# EAGLE schematic Rotating Section (EAGLE 9.4.2)
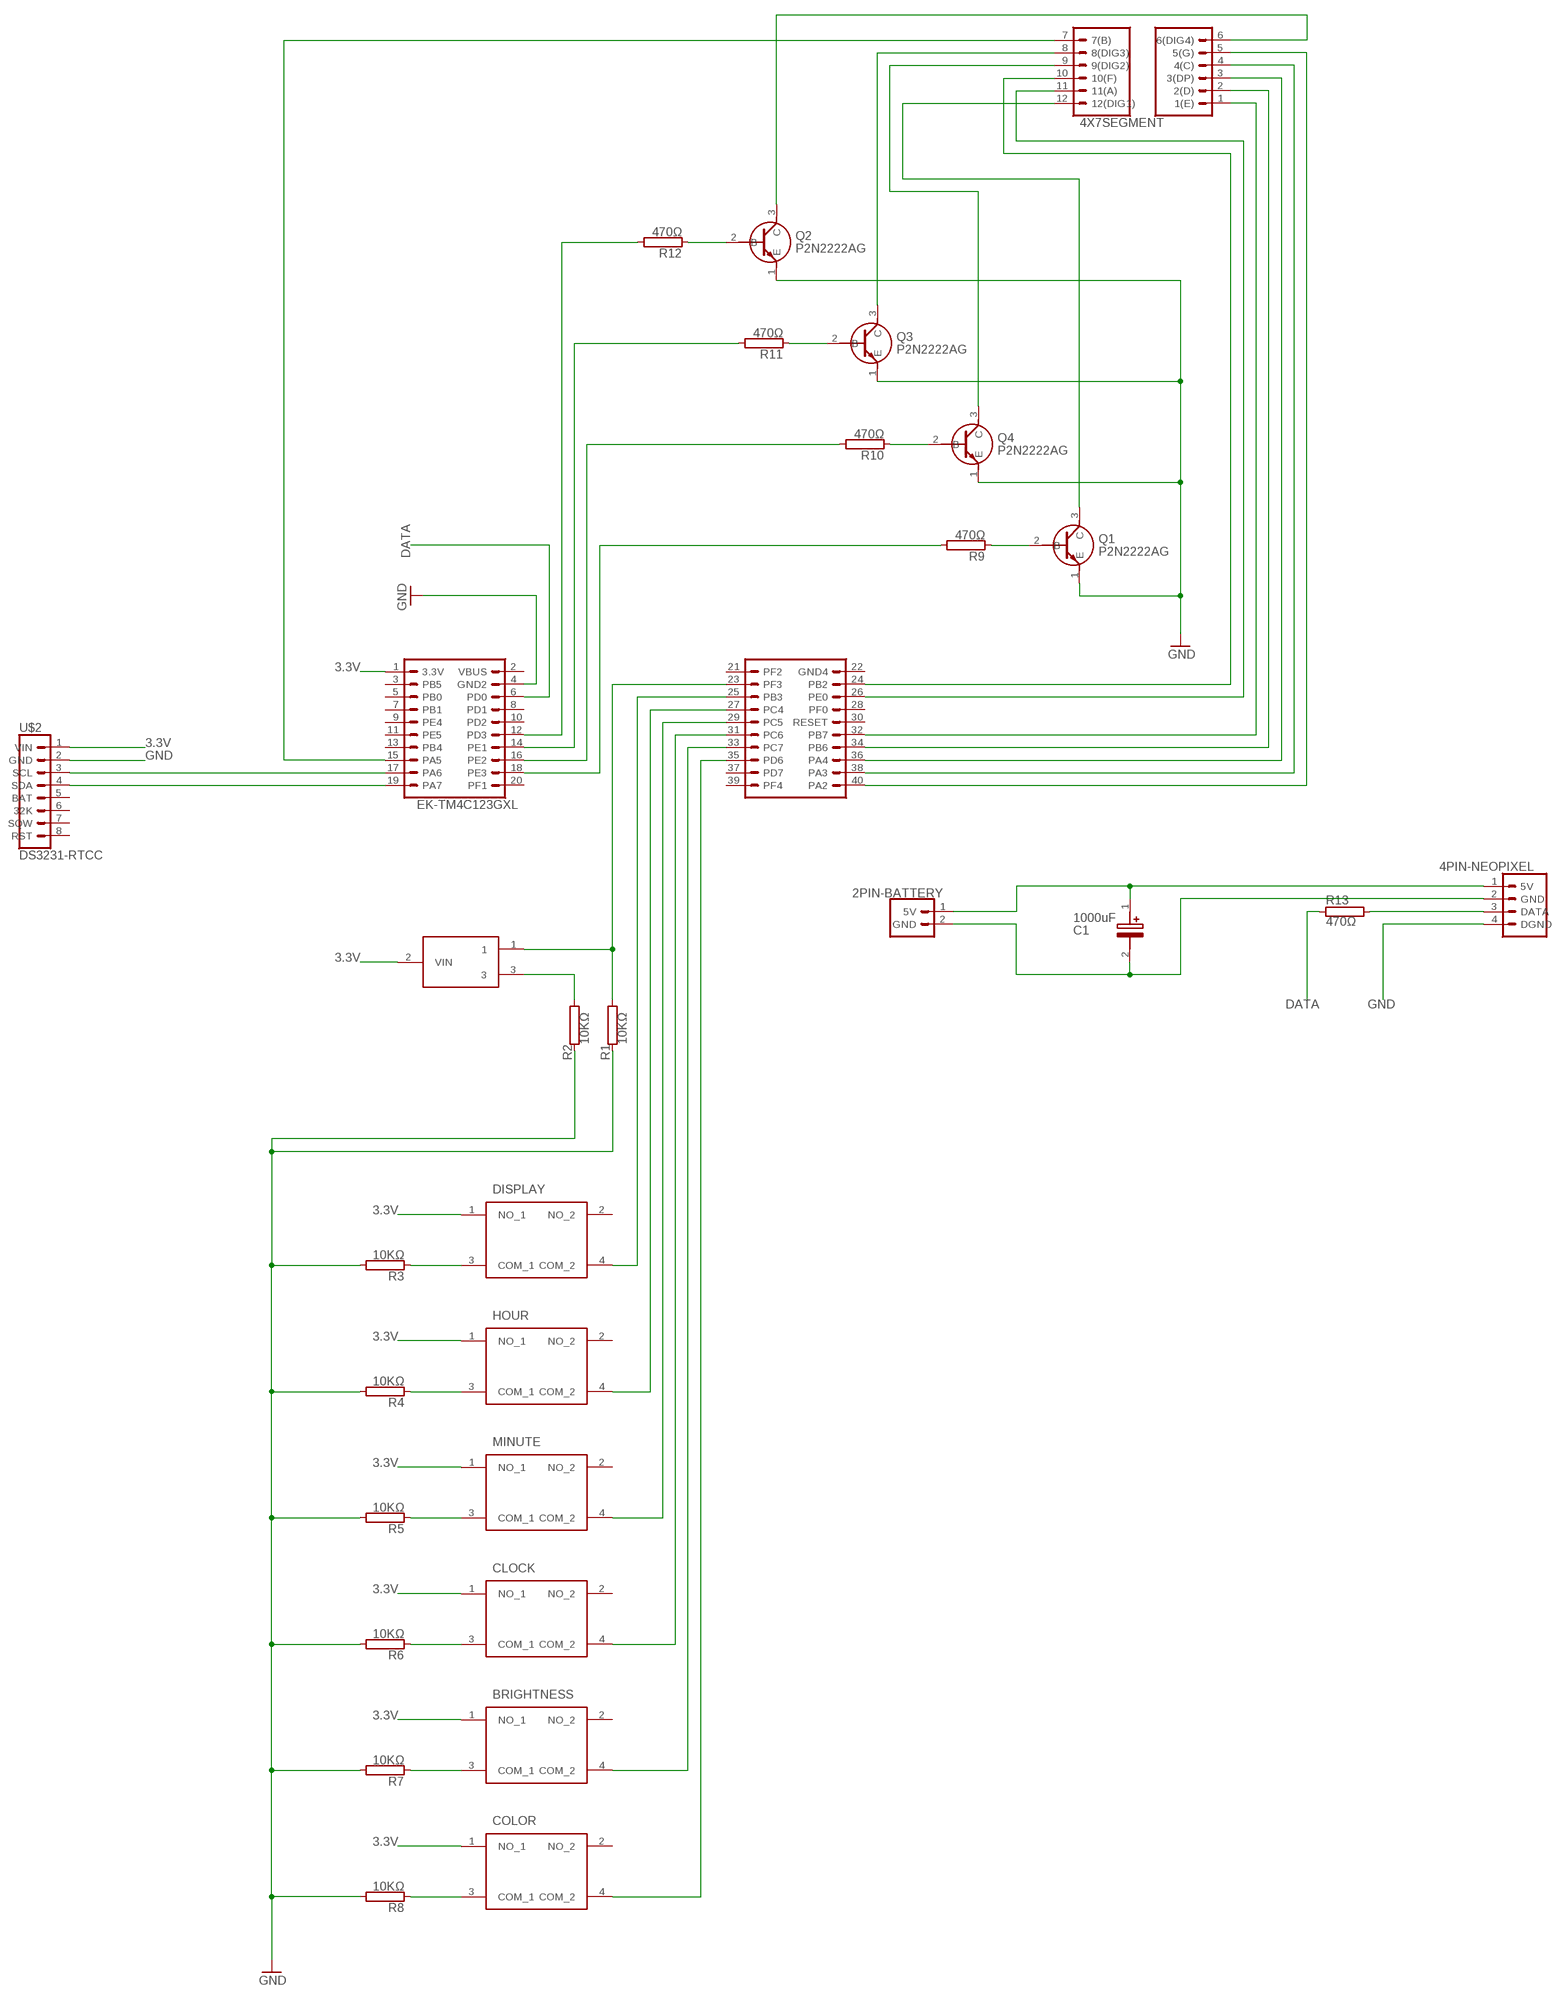
[diagram p0: schematic, sheet 1]

## Parts
BRIGHTNESS  PTS645SL432LFS  [PTS645SL432LFS]
C1  1000uF  EEU-FP1V102  [CAPPRD500W65D1250H2200]
CLOCK  PTS645SL432LFS  [PTS645SL432LFS]
COLOR  PTS645SL432LFS  [PTS645SL432LFS]
DISPLAY  PTS645SL432LFS  [PTS645SL432LFS]
HOUR  PTS645SL432LFS  [PTS645SL432LFS]
MINUTE  PTS645SL432LFS  [PTS645SL432LFS]
Q1  P2N2222AG  [TO-92]
Q2  P2N2222AG  [TO-92]
Q3  P2N2222AG  [TO-92]
Q4  P2N2222AG  [TO-92]
R1  10KΩ  RMG100-V  [TO-247-2V]
R2  10KΩ  RMG100-V  [TO-247-2V]
R3  10KΩ  RMG100-V  [TO-247-2V]
R4  10KΩ  RMG100-V  [TO-247-2V]
R5  10KΩ  RMG100-V  [TO-247-2V]
R6  10KΩ  RMG100-V  [TO-247-2V]
R7  10KΩ  RMG100-V  [TO-247-2V]
R8  10KΩ  RMG100-V  [TO-247-2V]
R9  470Ω  RMG100-V  [TO-247-2V]
R10  470Ω  RMG100-V  [TO-247-2V]
R11  470Ω  RMG100-V  [TO-247-2V]
R12  470Ω  RMG100-V  [TO-247-2V]
R13  470Ω  RMG100-V  [TO-247-2V]
S1  1101M2S3CQE2  [1000-SERIES(SPDT)]
U$1  4X7SEGMENT  [4X7SEGMENT]
U$2  DS3231-RTCC  [1X08]
U$3  EK-TM4C123GXL  [EK-TM4C123GXL]
U$4  4PIN-NEOPIXEL  [4PIN-NEOPIXEL]
U$5  2PIN-BATTERY  [2PIN-BATTERY]

## Nets
3.3V: BRIGHTNESS.1(NO_1) CLOCK.1(NO_1) COLOR.1(NO_1) DISPLAY.1(NO_1) HOUR.1(NO_1) MINUTE.1(NO_1) S1.2(VIN) U$2.1(VIN) U$3.1(3.3V)
DATA: R13.1 U$3.6(PD0)
GND: Q1.1(E) Q2.1(E) Q3.1(E) Q4.1(E) R1.1 R2.1 R3.2 R4.2 R5.2 R6.2 R7.2 R8.2 U$2.2(GND) U$3.4(GND2) U$4.4(DGND)
N$1: U$2.3(SCL) U$3.17(PA6)
N$2: U$2.4(SDA) U$3.19(PA7)
N$3: R2.2 S1.3
N$4: DISPLAY.4(COM_2) U$3.25(PB3)
N$5: R1.2 S1.1 U$3.23(PF3)
N$6: HOUR.4(COM_2) U$3.27(PC4)
N$7: MINUTE.4(COM_2) U$3.29(PC5)
N$8: CLOCK.4(COM_2) U$3.31(PC6)
N$9: BRIGHTNESS.4(COM_2) U$3.33(PC7)
N$10: COLOR.4(COM_2) U$3.35(PD6)
N$11: DISPLAY.3(COM_1) R3.1
N$12: HOUR.3(COM_1) R4.1
N$13: MINUTE.3(COM_1) R5.1
N$14: CLOCK.3(COM_1) R6.1
N$15: BRIGHTNESS.3(COM_1) R7.1
N$16: COLOR.3(COM_1) R8.1
N$17: R9.2 U$3.18(PE3)
N$18: Q1.2(B) R9.1
N$19: R11.2 U$3.14(PE1)
N$20: Q1.3(C) U$1.12(12(DIG1))
N$21: U$1.10(10(F)) U$3.24(PB2)
N$22: U$1.11(11(A)) U$3.26(PE0)
N$23: R10.2 U$3.16(PE2)
N$24: U$1.1(1(E)) U$3.32(PB7)
N$25: U$1.2(2(D)) U$3.34(PB6)
N$26: U$1.3(3(DP)) U$3.36(PA4)
N$27: U$1.4(4(C)) U$3.38(PA3)
N$28: U$1.5(5(G)) U$3.40(PA2)
N$29: U$1.7(7(B)) U$3.15(PA5)
N$30: Q4.2(B) R10.1
N$31: Q3.2(B) R11.1
N$32: R12.2 U$3.12(PD3)
N$33: Q4.3(C) U$1.9(9(DIG2))
N$34: Q3.3(C) U$1.8(8(DIG3))
N$35: Q2.2(B) R12.1
N$36: Q2.3(C) U$1.6(6(DIG4))
N$37: R13.2 U$4.3(DATA)
N$38: C1.1(+) U$4.1(5V) U$5.1(5V)
N$39: C1.2(-) U$4.2(GND) U$5.2(GND)
Unconnected: BRIGHTNESS.2(NO_2) CLOCK.2(NO_2) COLOR.2(NO_2) DISPLAY.2(NO_2) HOUR.2(NO_2) MINUTE.2(NO_2) U$2.6(32K) U$2.7(SQW) U$2.8(RST) U$3.3(PB5) U$3.5(PB0) U$3.7(PB1) U$3.8(PD1) U$3.9(PE4) U$3.10(PD2) U$3.11(PE5) U$3.13(PB4) U$3.20(PF1) U$3.21(PF2) U$3.28(PF0) U$3.30(RESET) U$3.37(PD7) U$3.39(PF4)

## Power pins joined to a net without a drawn wire
BAT: U$2.5(BAT)
GND4: U$3.22(GND4)
VBUS: U$3.2(VBUS)

## Library data of the parts
BRIGHTNESS CLOCK COLOR DISPLAY HOUR MINUTE = PTS645SL432LFS:PTS645SL432LFS: Tactile Switches SWITCH TACTILE Source: Datasheet <https://www.mouser.com/datasheet/2/60/pts645-965362.pdf>; DESCRIPTION: Tactile Switches SWITCH TACTILE; HEIGHT: 4.4mm; MANUFACTURER_NAME: C&K Switches; MANUFACTURER_PART_NUMBER: PTS645SL432LFS; MOUSER_PART_NUMBER: 611-PTS645SL432
C1 = EEU-FP1V102:EEU-FP1V102: Aluminum Electrolytic Capacitors - Radial Leaded 35VDC 1000uF 20% ESR 0.038ohm AECQ200 Source: Datasheet <https://componentsearchengine.com/Datasheets/1/EEU-FP1V102.pdf>; DESCRIPTION: Aluminum Electrolytic Capacitors - Radial Leaded 35VDC 1000uF 20% ESR 0.038ohm AECQ200; HEIGHT: 22mm; MANUFACTURER_NAME: Panasonic; MANUFACTURER_PART_NUMBER: EEU-FP1V102; MOUSER_PART_NUMBER: 667-EEU-FP1V102; MOUSER_PRICE-STOCK: https://www.mouser.com/Search/Refine.aspx?Keyword=667-EEU-FP1V102
Q1-Q4 = 2N2222A:P2N2222AG: NPN transistor,P2N2222A 0.6A Ic 10Vce ON Semi P2N2222AG NPN Bipolar Transistor, 0.6 A 40 V, 3-Pin TO-92 Source: Datasheet <https://componentsearchengine.com/Datasheets/1/P2N2222AG.pdf>; DESCRIPTION: NPN transistor,P2N2222A 0.6A Ic 10Vce ON Semi P2N2222AG NPN Bipolar Transistor, 0.6 A 40 V, 3-Pin TO-92; HEIGHT: mm; MANUFACTURER_NAME: ON Semiconductor; MANUFACTURER_PART_NUMBER: P2N2222AG; MOUSER_PART_NUMBER: 863-P2N2222AG; MOUSER_PRICE-STOCK: https://www.mouser.com/Search/Refine.aspx?Keyword=863-P2N2222AG
R1-R13 = resistor-power:RMG100: TO-247 Power Resistor - RMG 100 Series Source: www.token.com.tw .. power-resistor-rmg100pdf; OC_FARNELL: unknown; OC_NEWARK: unknown
S1 = Slide Switch 1101M2S3CQE2:1101M2S3CQE2: 1101M2S3CQE2 (Slide Switches) Source: Datasheet <https://componentsearchengine.com/Datasheets/1/1101M2S3CQE2.pdf>; DESCRIPTION: 1101M2S3CQE2 (Slide Switches); HEIGHT: mm; MANUFACTURER_NAME: C & K COMPONENTS; MANUFACTURER_PART_NUMBER: 1101M2S3CQE2; MOUSER_PART_NUMBER: 611-1101M2S3CQE2; MOUSER_PRICE-STOCK: https://www.mouser.com/Search/Refine.aspx?Keyword=611-1101M2S3CQE2
U$1 = Misc:4X7SEGMENT
U$2 = Misc:DS3231-RTCC
U$3 = Misc:EK-TM4C123GXL: EK-TM4C123GXL Tiva C-Series Launchpad Revision B Development board
U$4 = Custom:4PIN-NEOPIXEL
U$5 = Custom:2PIN-BATTERY